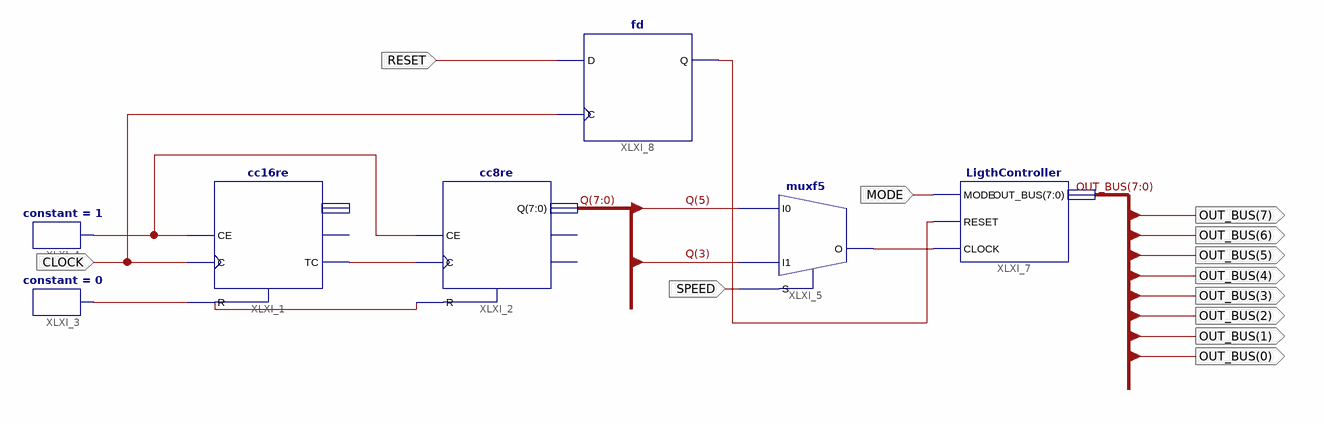
[diagram p0: schematic sheet 1]
// Xilinx ISE schematic TopLevel.sch (spartan3a) as structural Verilog: 7 symbols, 12 ports
module TopLevel (
  input  CLOCK,
  input  SPEED,
  input  MODE,
  input  RESET,
  output [7:0] OUT_BUS
);

  wire XLXN_1, XLXN_2, XLXN_4, XLXN_11, XLXN_23, XLXN_33;
  wire [7:0] Q;

  cc16re XLXI_1 (.C(CLOCK), .CE(XLXN_2), .R(XLXN_1), .TC(XLXN_23));  // open: CEO, Q
  cc8re XLXI_2 (.C(XLXN_23), .CE(XLXN_2), .R(XLXN_4), .Q(Q));  // open: CEO, TC
  constant #(.CValue("0")) XLXI_3 (.O(XLXN_1));
  constant #(.CValue("1")) XLXI_4 (.O(XLXN_2));
  muxf5 XLXI_5 (.I0(Q[5]), .I1(Q[3]), .S(SPEED), .O(XLXN_11));
  LigthController XLXI_7 (.MODE(MODE), .RESET(XLXN_33), .CLOCK(XLXN_11), .OUT_BUS(OUT_BUS));
  fd XLXI_8 (.C(CLOCK), .D(RESET), .Q(XLXN_33));
endmodule
